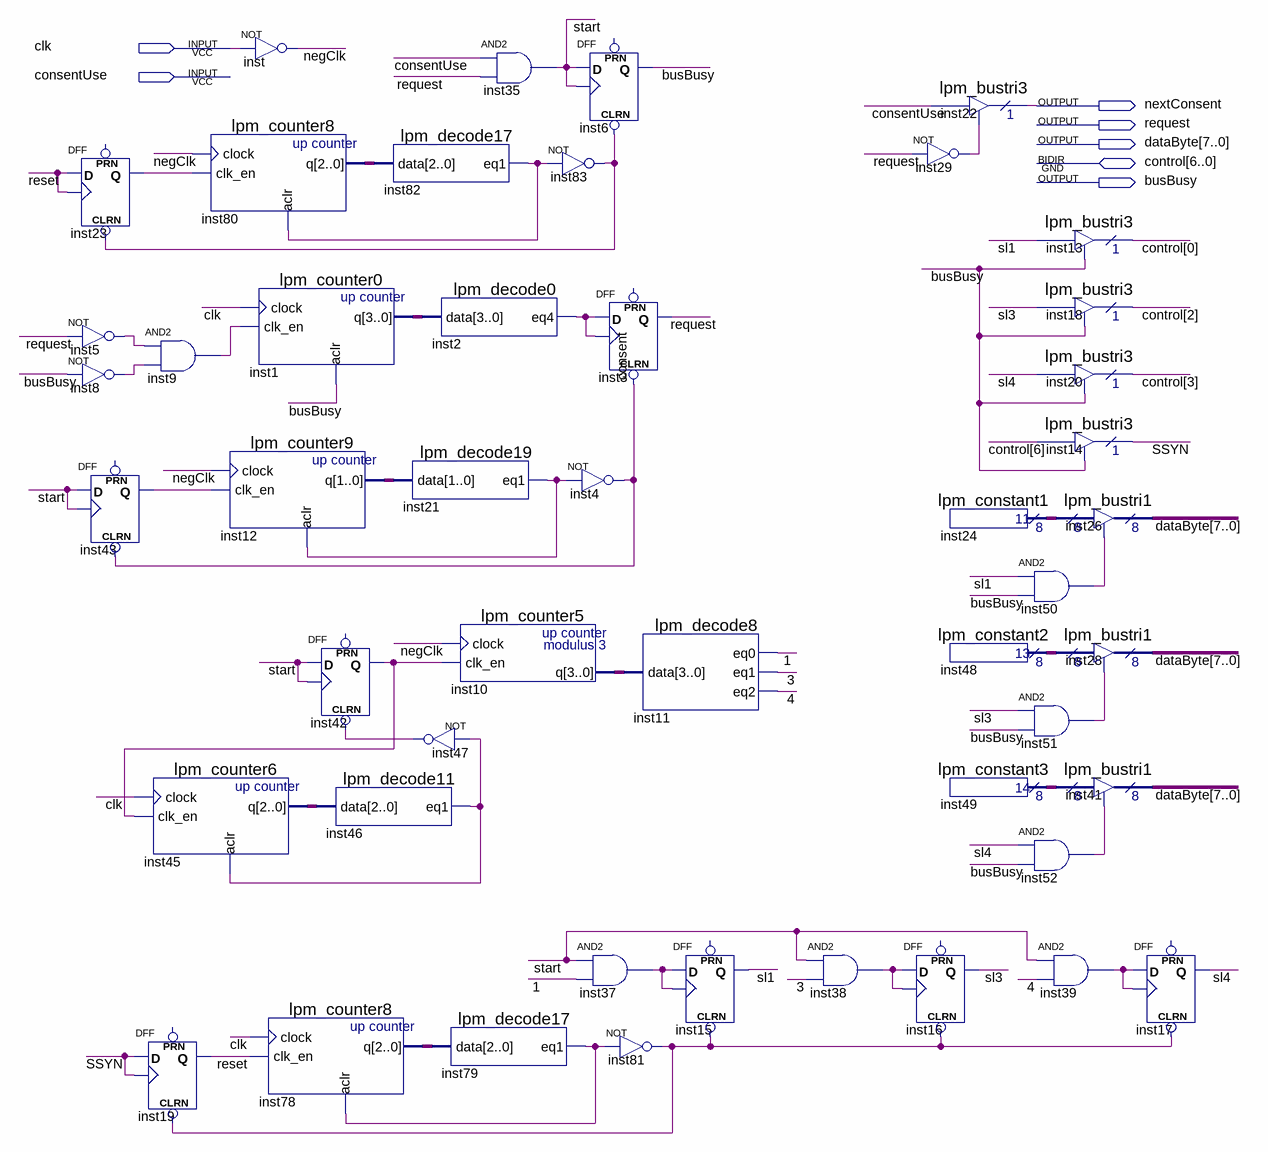
[diagram p0: schematic sheet]
// Quartus schematic Master1.bdf as structural Verilog: 48 symbols, 7 pins
module Master1 (
  input  clk,
  input  consentUse,
  inout  [6:0] control,
  output nextConsent,
  output request,
  output [7:0] dataByte,
  output busBusy
);

  wire \1 , \3 , \4 , consent, inst2_eq4, inst5_out, inst8_out, inst9_out, inst21_eq1, inst23_q, inst29_out,
       inst37_out, inst38_out, inst39_out, inst42_q, inst43_q, inst46_eq1, inst47_out, inst50_out,
       inst51_out, inst52_out, inst79_eq1, inst81_out, inst82_eq1, inst83_out, negClk, reset, sl1, sl3, sl4,
       SSYN, start;
  wire [1:0] inst12_q;
  wire [2:0] inst45_q, inst78_q, inst80_q;
  wire [3:0] inst1_q, inst10_q;
  wire [7:0] inst24_result, inst48_result, inst49_result;

  DFF inst23 (.CLRN(inst83_out), .CLK(reset), .D(reset), .Q(inst23_q));  // open: PRN
  not inst5 (inst5_out, request);
  not inst8 (inst8_out, busBusy);
  DFF inst43 (.CLRN(consent), .CLK(start), .D(start), .Q(inst43_q));  // open: PRN
  lpm_counter8 inst80 (.clock(negClk), .clk_en(inst23_q), .aclr(inst82_eq1), .q(inst80_q));
  and inst9 (inst9_out, inst5_out, inst8_out);
  lpm_counter6 inst45 (.clock(clk), .clk_en(inst42_q), .aclr(inst46_eq1), .q(inst45_q));
  DFF inst19 (.CLRN(inst81_out), .CLK(SSYN), .D(SSYN), .Q(reset));  // open: PRN
  not inst (negClk, clk);
  lpm_counter0 inst1 (.clock(clk), .clk_en(inst9_out), .aclr(busBusy), .q(inst1_q));
  lpm_counter9 inst12 (.clock(negClk), .clk_en(inst43_q), .aclr(inst21_eq1), .q(inst12_q));
  lpm_counter8 inst78 (.clock(clk), .clk_en(reset), .aclr(inst79_eq1), .q(inst78_q));
  DFF inst42 (.CLRN(inst47_out), .CLK(start), .D(start), .Q(inst42_q));  // open: PRN
  lpm_decode11 inst46 (.data(inst45_q), .eq1(inst46_eq1));
  lpm_decode17 inst82 (.data(inst80_q), .eq1(inst82_eq1));
  lpm_decode0 inst2 (.data(inst1_q), .eq4(inst2_eq4));
  lpm_decode19 inst21 (.data(inst12_q), .eq1(inst21_eq1));
  not inst47 (inst47_out, inst46_eq1);
  and inst35 (start, consentUse, request);
  lpm_counter5 inst10 (.clock(negClk), .clk_en(inst42_q), .q(inst10_q));
  lpm_decode17 inst79 (.data(inst78_q), .eq1(inst79_eq1));
  DFF inst6 (.CLRN(inst83_out), .CLK(start), .D(start), .Q(busBusy));  // open: PRN
  not inst83 (inst83_out, inst82_eq1);
  not inst4 (consent, inst21_eq1);
  and inst37 (inst37_out, start, \1 );
  DFF inst3 (.CLRN(consent), .CLK(inst2_eq4), .D(inst2_eq4), .Q(request));  // open: PRN
  lpm_decode8 inst11 (.data(inst10_q), .eq0(\1 ), .eq1(\3 ), .eq2(\4 ));
  not inst81 (inst81_out, inst79_eq1);
  DFF inst15 (.CLRN(inst81_out), .CLK(inst37_out), .D(inst37_out), .Q(sl1));  // open: PRN
  and inst38 (inst38_out, start, \3 );
  lpm_bustri3 inst22 (.enabledt(inst29_out), .data(consentUse), .tridata(nextConsent));
  not inst29 (inst29_out, request);
  lpm_constant1 inst24 (.result(inst24_result));
  lpm_constant2 inst48 (.result(inst48_result));
  lpm_constant3 inst49 (.result(inst49_result));
  DFF inst16 (.CLRN(inst81_out), .CLK(inst38_out), .D(inst38_out), .Q(sl3));  // open: PRN
  lpm_bustri3 inst13 (.enabledt(busBusy), .data(sl1), .tridata(control[0]));
  lpm_bustri3 inst18 (.enabledt(busBusy), .data(sl3), .tridata(control[2]));
  lpm_bustri3 inst20 (.enabledt(busBusy), .data(sl4), .tridata(control[3]));
  lpm_bustri3 inst14 (.enabledt(busBusy), .data(control[6]), .tridata(SSYN));
  and inst50 (inst50_out, sl1, busBusy);
  and inst51 (inst51_out, sl3, busBusy);
  and inst52 (inst52_out, sl4, busBusy);
  and inst39 (inst39_out, start, \4 );
  lpm_bustri1 inst26 (.enabledt(inst50_out), .data(inst24_result), .tridata(dataByte));
  lpm_bustri1 inst28 (.enabledt(inst51_out), .data(inst48_result), .tridata(dataByte));
  lpm_bustri1 inst41 (.enabledt(inst52_out), .data(inst49_result), .tridata(dataByte));
  DFF inst17 (.CLRN(inst81_out), .CLK(inst39_out), .D(inst39_out), .Q(sl4));  // open: PRN
endmodule
